# Altium schematic sheet Charging.SchDoc
size A
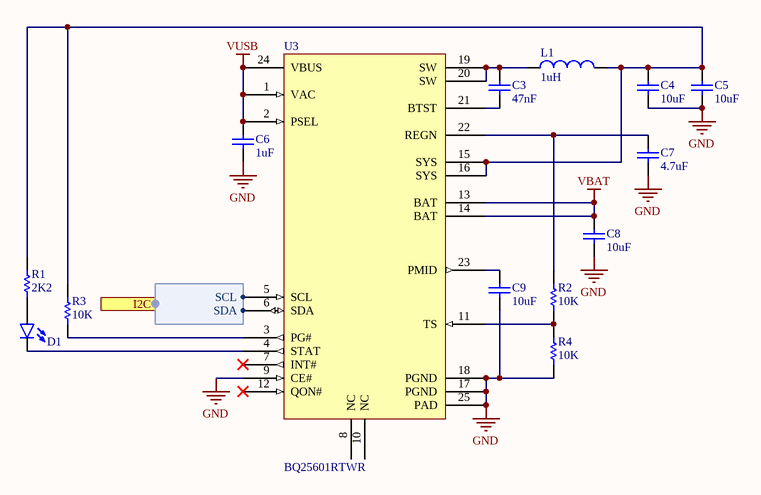
[diagram p0: Charging.SchDoc]

## Parts
C3  value 47nF  [C0402[1005X55]]  (hidden comment: 47nF 16V 0402)
C4  value 10uF  [C0402[1005X55]]  (hidden comment: 10uF 6.3V 0402)
C5  value 10uF  [C0402[1005X55]]  (hidden comment: 10uF 6.3V 0402)
C6  value 1uF  [C0402[1005X55]]  (hidden comment: 1uF 16V 0402)
C7  value 4.7uF  [C0402[1005X55]]  (hidden comment: 4.7uF 10V 0402)
C8  value 10uF  [C0402[1005X55]]  (hidden comment: 10uF 6.3V 0402)
C9  value 10uF  [C0603[1608X92]]  (hidden comment: 10uF 35V 0603)
D1  LED_0603_GREEN_5mA  [LED0603]  (value not drawn)
L1  1uH  [IND1008]
R1  value 2K2  [R0402[1005]]  (hidden comment: 2K2 1% 0402)
R2  value 10K  [R0402[1005]]  (hidden comment: 10K 1% 0402)
R3  value 10K  [R0402[1005]]  (hidden comment: 10K 1% 0402)
R4  value 10K  [R0402[1005]]  (hidden comment: 10K 1% 0402)
U3  BQ25601RTWR  [WQFN-24]

## Ports
I2C (harness I2C)

## Harnesses
I2C: SCL, SDA

## Nets
GND: C4.1 C5.1 C6.1 C7.1 C8.1 C9.1 R4.1 U3.9(CE#) U3.17(PGND) U3.18(PGND) U3.25(PAD)
VBAT: C8.2 U3.13(BAT) U3.14(BAT)
VUSB: C6.2 U3.1(VAC) U3.2(PSEL) U3.24(VBUS)
NetC3_1: C3.1 U3.21(BTST)
NetC3_2: C3.2 L1.1 U3.19(SW) U3.20(SW)
NetC4_2: C4.2 C5.2 L1.2 R1.2 R3.2 U3.15(SYS) U3.16(SYS)
NetC7_2: C7.2 R2.2 U3.22(REGN)
NetC9_2: C9.2 U3.23(PMID)
NetD1_A: D1.A R1.1
NetD1_C: D1.C U3.4(STAT)
NetR2_1: R2.1 R4.2 U3.11(TS)
NetR3_1: R3.1 U3.3(PG#)
NetU3_5: U3.5(SCL) ; port I2C.SCL
NetU3_6: U3.6(SDA) ; port I2C.SDA

Not connected (* = marked no-connect by the designer): U3 7(INT#)* 8(NC) 10(NC) 12(QON#)*

## Library data of the parts
C3 = CAP_47nF_16V_0402_10%: 47nF 16V 10% 0402 (1005 Metric); PartNumber: GCM155R71C473KA37D; Manufacturer: Murata; Mounting Technology: Surface Mount; PackageReference: 0402; PackageDescription: 0402 (1005 Metric); Voltage: 16V; Tolerance: 10%
C4 C5 C8 = CAP_10uF_6.3V_0402_20%: 10uF 6.3V 20% 0402 (1005 Metric); PartNumber: GRM155R60J106ME44D; Manufacturer: Murata; Mounting Technology: Surface Mount; PackageReference: 0402; PackageDescription: 0402 (1005 Metric); Voltage: 6.3V; Tolerance: 20%
C6 = CAP_1uF_16V_0402_10%: 1uF 16V 10% 0402 (1005 Metric); PartNumber: GRM155R61C105KE01D; Manufacturer: Murata; Mounting Technology: Surface Mount; PackageReference: 0402; PackageDescription: 0402 (1005 Metric); Voltage: 16V; Tolerance: 10%
C7 = CAP_4.7uF_10V_0402_10%: 4.7uF 10V 10% 0402 (1005 Metric); PartNumber: ZRB15XR61A475KE01D; Manufacturer: Murata; Mounting Technology: Surface Mount; PackageReference: 0402; PackageDescription: 0402 (1005 Metric); Voltage: 10V; Tolerance: 10%
C9 = CAP_10uF_35V_0603_10%: 10uF 35V 10% 0603 (1608 Metric); PartNumber: GRM188R6YA106MA73D; Manufacturer: Murata; Mounting Technology: Surface Mount; PackageReference: 0603; PackageDescription: 0603 (1608 Metric); Voltage: 35V; Tolerance: 10%
D1 = LED_0603_GREEN_5mA: PartNumber: LTST-C193TGKT-5A; Manufacturer: Lite-On Inc.; PackageReference: 0603; PackageDescription: 0603 (1608 Metric); Mounting Technology: Surface Mount
L1 = IND_1uH_4.7A_1008_20%: 1uH 20% 4.7A 1008; PartNumber: DFE252012F-2R2M=P2; Manufacturer: Murata; PackageReference: 1008; PackageDescription: 1008 (2520 metric); Mounting Technology: Surface Mount; Current: 4.7A; Value: 1uH
R1 = RES_2K2_0402_1%: 2K2 0.063W 1% 0402 (1005 Metric); Manufacturer: KOA Speer; PartNumber: RK73H1ETTP2201F; Tolerance: 1%; Power: 0.063W; Mounting Technology: Surface Mount; PackageReference: 0402; PackageDescription: 0402 (1005 Metric); ComponentLink1Description: Datasheet; ComponentLink1URL: http://www.koaspeer.com/catimages/Products/RK73H/RK73H.pdf
R2-R4 = RES_10K_0402_1%: 10K 0.063W 1% 0402 (1005 Metric); Manufacturer: KOA Speer; PartNumber: RK73H1ETTP1002F; Tolerance: 1%; Power: 0.063W; Mounting Technology: Surface Mount; PackageReference: 0402; PackageDescription: 0402 (1005 Metric); ComponentLink1Description: Datasheet; ComponentLink1URL: http://www.koaspeer.com/catimages/Products/RK73H/RK73H.pdf
U3 = BQ25601RTWR: Battery Management I2C Controlled Single Cell 3-A Battery Charger with High Input Voltage and Power Path 24-WQFN -40 to 85; Manufacturer: Texas Instruments; PartNumber: Battery Management I2C Controlled Single Cell 3-A Battery Charger with High Input Voltage and Power Path 24-WQFN -40 to 85; PackageReference: WQFN-24; Mounting Technology: Surface Mount